# Altium schematic sheet main_2021-12-09.schdoc
size 348 x 153 mm
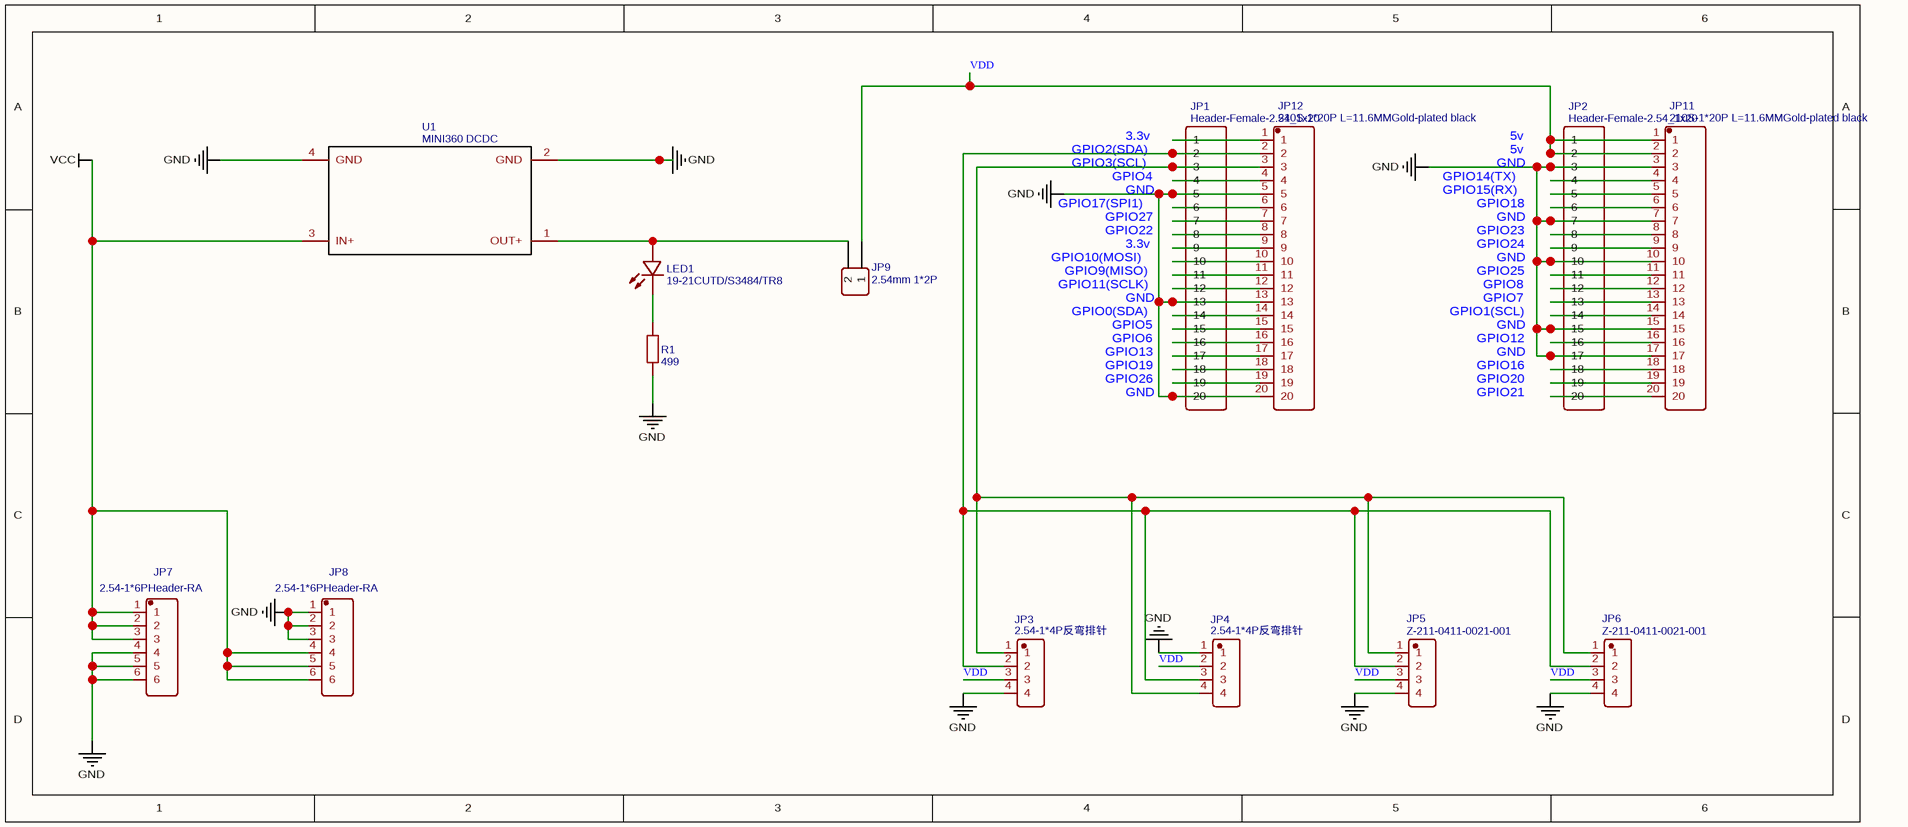
[diagram p0: main_2021-12-09.schdoc]

## Parts
JP1  Header-Female-2.54_1x20  [HDR-TH_20P-P2.54-V-F]
JP2  Header-Female-2.54_1x20  [HDR-TH_20P-P2.54-V-F]
JP3  2.54-1*4P反弯排针  [HDR-TH_4P-P2.54-H-M-W10.4]
JP4  2.54-1*4P反弯排针  [HDR-TH_4P-P2.54-H-M-W10.4]
JP5  Z-211-0411-0021-001  [HDR-TH_4P-P2.54-V-M]
JP6  Z-211-0411-0021-001  [HDR-TH_4P-P2.54-V-M]
JP7  2.54-1*6PHeader-RA  [HDR-TH_6P-P2.54-H-M-W10.0]
JP8  2.54-1*6PHeader-RA  [HDR-TH_6P-P2.54-H-M-W10.0]
JP9  2.54mm 1*2P  [HDR-TH_2P-P2.54-V-M]
JP11  210S-1*20P L=11.6MMGold-plated black  [HDR-TH_20P-P2.54-V-M-1]
JP12  210S-1*20P L=11.6MMGold-plated black  [HDR-TH_20P-P2.54-V-M-1]
LED1  19-21CUTD/S3484/TR8  [LED0603-R-RD]
R1  499  [R0603]
U1  MINI360 DCDC  [MINI360]

## Nets
GND: JP1.5 JP1.13 JP1.20 JP2.3 JP2.7 JP2.10 JP2.15 JP2.17 JP3.4 JP4.1 JP5.4 JP6.4 JP7.4 JP7.5 JP7.6 JP8.1 JP8.2 JP8.3 JP11.3 JP11.7 JP11.10 JP11.15 JP11.17 JP12.5 JP12.13 JP12.20 R1.1 U1.2(GND) U1.4(GND)
VCC: JP7.1 JP7.2 JP7.3 JP8.4 JP8.5 JP8.6 U1.3(IN+)
VDD: JP2.1 JP2.2 JP3.3 JP4.2 JP5.3 JP6.3 JP9.1 JP11.1 JP11.2
NetJP1_1: JP1.1 JP12.1
NetJP1_2: JP1.2 JP3.2 JP4.3 JP5.2 JP6.2 JP12.2
NetJP1_3: JP1.3 JP3.1 JP4.4 JP5.1 JP6.1 JP12.3
NetJP1_4: JP1.4 JP12.4
NetJP1_6: JP1.6 JP12.6
NetJP1_7: JP1.7 JP12.7
NetJP1_8: JP1.8 JP12.8
NetJP1_9: JP1.9 JP12.9
NetJP1_10: JP1.10 JP12.10
NetJP1_11: JP1.11 JP12.11
NetJP1_12: JP1.12 JP12.12
NetJP1_14: JP1.14 JP12.14
NetJP1_15: JP1.15 JP12.15
NetJP1_16: JP1.16 JP12.16
NetJP1_17: JP1.17 JP12.17
NetJP1_18: JP1.18 JP12.18
NetJP1_19: JP1.19 JP12.19
NetJP2_4: JP2.4 JP11.4
NetJP2_5: JP2.5 JP11.5
NetJP2_6: JP2.6 JP11.6
NetJP2_8: JP2.8 JP11.8
NetJP2_9: JP2.9 JP11.9
NetJP2_11: JP2.11 JP11.11
NetJP2_12: JP2.12 JP11.12
NetJP2_13: JP2.13 JP11.13
NetJP2_14: JP2.14 JP11.14
NetJP2_16: JP2.16 JP11.16
NetJP2_18: JP2.18 JP11.18
NetJP2_19: JP2.19 JP11.19
NetJP2_20: JP2.20 JP11.20
NetJP9_2: JP9.2 LED1.1(A) U1.1(OUT+)
NetLED1_2: LED1.2(K) R1.2

## Notes on the sheet
- GPIO2(SDA)
- GPIO3(SCL)
- (near JP1) 3.3v
- (near JP2) GND
- (near JP2) 5v
- GPIO17(SPI1)
- (near JP1) GPIO27
- (near JP1) GPIO22
- (near JP1) GPIO4
- (near JP1) GND
- GPIO14(TX)
- GPIO15(RX)
- (near JP2) GPIO18
- (near JP2) GPIO23
- GPIO10(MOSI)
- GPIO11(SCLK)
- GPIO9(MISO)
- (near JP2) GPIO24
- (near JP2) GPIO25
- (near JP2) GPIO8
- (near JP2) GPIO7
- GPIO0(SDA)
- (near JP1) GPIO13
- (near JP1) GPIO19
- (near JP1) GPIO5
- (near JP1) GPIO6
- GPIO1(SCL)
- (near JP2) GPIO12
- (near JP2) GPIO16
- (near JP1) GPIO26
- (near JP2) GPIO20
- (near JP2) GPIO21

## Library data of the parts
JP1 JP2 = Header-Female-2.54_1x20: BOM_Manufacturer: BOOMELE; BOM_Manufacturer Part: 2.54mm 1*20P Female header; BOM_Supplier: LCSC; BOM_Supplier Part: C50984; BOM_JLCPCB Part Class: Extended Part; spicePre: P; spiceSymbolName: Header-Female-2.54_1x20
JP3 JP4 = 2.54-1*4P反弯排针: BOM_Manufacturer: BOOMELE(博穆精密); Contributor: LCSC; BOM_Supplier: LCSC; BOM_Supplier Part: C91552; BOM_Manufacturer Part: 2.54-1*4P反弯排针; BOM_JLCPCB Part Class: Extended Part; spicePre: H; spiceSymbolName: 2.54-1*4P反弯排针
JP5 JP6 = Z-211-0411-0021-001: BOM_Manufacturer: ZHENGLING; Contributor: LCSC; BOM_Supplier: LCSC; BOM_Manufacturer Part: Z-211-0411-0021-001; BOM_Supplier Part: C152150; BOM_JLCPCB Part Class: Extended Part; spicePre: H; spiceSymbolName: Z-211-0411-0021-001
JP7 JP8 = 2.54-1*6PHeader-RA: BOM_Manufacturer: BOOMELE; spicePre: X; BOM_Supplier: LCSC; BOM_Manufacturer Part: 2.54-1*6PHeader; BOM_Supplier Part: C56816; BOM_JLCPCB Part Class: Extended Part; spiceSymbolName: 2.54-1*6PHeader-RA
JP9 = 2.54mm 1*2P: BOM_Manufacturer: ReliaPro; BOM_Supplier: LCSC; BOM_Manufacturer Part: 2.54mm 1*2P; BOM_Supplier Part: C36717; spicePre: P; spiceSymbolName: 2.54mm 1*2P
JP11 JP12 = 210S-1*20P L=11.6MMGold-plated black: BOM_Manufacturer: Ckmtw; Contributor: LCSC; BOM_Supplier: LCSC; BOM_Manufacturer Part: 210S-1*20P L=11.6MMGold-plated black; BOM_Supplier Part: C124374; BOM_JLCPCB Part Class: Extended Part; spicePre: H; spiceSymbolName: 210S-1*20P L=11.6MMGold-plated black
LED1 = 19-21CUTD/S3484/TR8: BOM_Manufacturer: Everlight Elec; Contributor: LCSC; BOM_Supplier: LCSC; BOM_Supplier Part: C264445; BOM_Manufacturer Part: 19-21CUTD/S3484/TR8; JLCPCB Part Class: Extended Part; BOM_JLCPCB Part Class: Extended Part; spicePre: L; spiceSymbolName: 19-21CUTD/S3484/TR8
R1 = 499: BOM_Manufacturer: TA-I Tech; BOM_Manufacturer Part: RMS06FT4990; nameAlias: Resistance (Ohms); Contributor: LCSC; BOM_Supplier: LCSC; BOM_Supplier Part: C209153; BOM_JLCPCB Part Class: Extended Part; spicePre: R; spiceSymbolName: RMS06FT4990
U1 = MINI360 DCDC: Contributor: libc0607; spicePre: U; spiceSymbolName: MINI360 DCDC